# Altium schematic sheet [03] - MCU.SchDoc
size A4
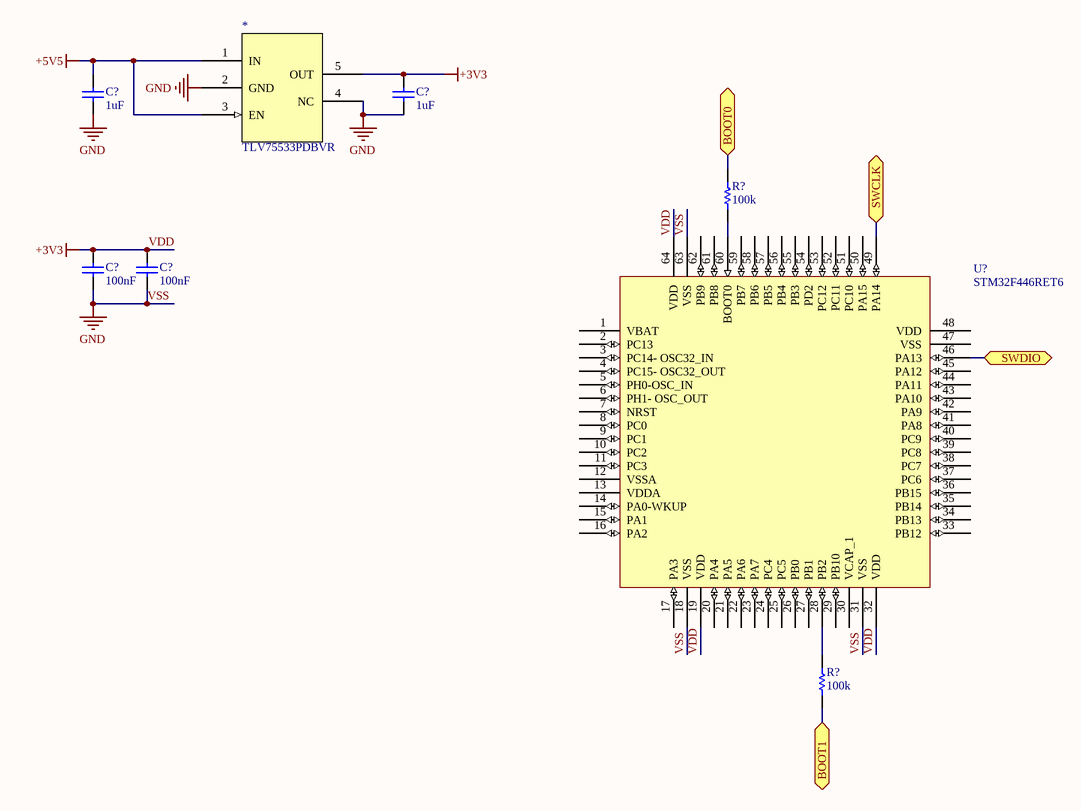
[diagram p0: [03] - MCU.SchDoc]

## Parts
(Parts that share a designator on the sheet are numbered #1, #2 ... from top to bottom, then left to right.)
*  TLV75533PDBVR  [SOT23127P600-8N]
C?#1  1uF
C?#2  1uF
C?#3  100nF
C?#4  100nF
R?#1  100k
R?#2  100k
U?  STM32F446RET6

## Ports
BOOT0, BOOT1, SWCLK, SWDIO

## Nets
+5V5: *.1(IN) *.3(EN) C?#1.2
VDD: *.5(OUT) C?#2.2 C?#3.2 C?#4.2 U?.19(VDD) U?.32(VDD) U?.64(VDD)  [also labelled +3V3]
VSS: *.2(GND) *.4(NC) C?#1.1 C?#2.1 C?#3.1 C?#4.1 U?.18(VSS) U?.31(VSS) U?.63(VSS)  [also labelled GND]
BOOT0: R?#1.2 ; port BOOT0
BOOT1: R?#2.1 ; port BOOT1
SWCLK: U?.49(PA14) ; port SWCLK
SWDIO: U?.46(PA13) ; port SWDIO
NetR?#1_1: R?#1.1 U?.60(BOOT0)
NetR?#2_2: R?#2.2 U?.28(PB2)

Not connected (* = marked no-connect by the designer): U? 1(VBAT) 2(PC13) 3(PC14-_OSC32_IN) 4(PC15-_OSC32_OUT) 5(PH0-OSC_IN) 6(PH1-_OSC_OUT) 7(NRST) 8(PC0) 9(PC1) 10(PC2) 11(PC3) 12(VSSA) 13(VDDA) 14(PA0-WKUP) 15(PA1) 16(PA2) 17(PA3) 20(PA4) 21(PA5) 22(PA6) 23(PA7) 24(PC4) 25(PC5) 26(PB0) 27(PB1) 29(PB10) 30(VCAP_1) 33(PB12) 34(PB13) 35(PB14) 36(PB15) 37(PC6) 38(PC7) 39(PC8) 40(PC9) 41(PA8) 42(PA9) 43(PA10) 44(PA11) 45(PA12) 47(VSS) 48(VDD) 50(PA15) 51(PC10) 52(PC11) 53(PC12) 54(PD2) 55(PB3) 56(PB4) 57(PB5) 58(PB6) 59(PB7) 61(PB8) 62(PB9)

## Library data of the parts
* = TLV75533PDBVR: LDO Voltage Regulators 500-mA, Low IQ, Small Size, Low Dropout Regulator 5-SOT-23 -40 to 125; Manufacturer: Texas Instruments; Input Voltage MAX: 5.5 V; Number of Outputs: 1 Output; Output Current: 500 mA; Output Type: Fixed; Output Voltage: 3.3 V; Quiescent Current: 25 uA; Dropout Voltage - Max: 215 mV; PSRR / Ripple Rejection - Typ: 46 dB; Voltage Regulation Accuracy: 1.5 %; CNHTS: 8542319000; Dropout Voltage: 220 mV; Input Voltage MIN: 1.45 V; Line Regulation: 2 mV; Load Regulation: 0.06 V/A; Polarity: Positive; Product Status: New Product; Supplier 1: Mouser; Manufacturer Part Number: TLV75533PDBVR; RoHS: RoHS Compliant; Category: LDO Voltage Regulators; Stock 1: 52559; Pricing 1: 1=0.541, 10=0.454, 100=0.292, 1000=0.234, 2000=0.212, 3000=0.197, 9000=0.190 (EUR); Operating Temperature Range: - 40 C to + 125 C; Package/Case: SOT-23-5; Packaging: Cut Tape; Product: LDO Voltage Regulators; Series: TLV755P; Type: Low Quiescent Current, Ultra Small; Brand: Texas Instruments; Mounting Style: SMD/SMT; Output Voltage Range: -; HTS Code: 8542390001; Maximum Operating Temperature: + 125 C; Minimum Operating Temperature: - 40 C; Product Type: LDO Voltage Regulators; Standard Pack Qty: 3000; Subcategory: PMIC - Power Management ICs; RoHS - Mouser: Y; Minimum Order Quantity: 1; Reeling: True; Supplier Part Number 1: 595-TLV75533PDBVR
C?#1 C?#2 = GRM32RF51E105ZA01L: Multilayer Ceramic Capacitors MLCC - SMD/SMT 1210 1uF 25volts Y5V +80-20%; Manufacturer: Murata Electronics; Tolerance: - 20 %, + 80 %; Type: Chip Multilayer Ceramic Capacitor for General Purpose; Voltage Rating DC: 25 VDC; Capacitance - nF: 1000 nF; Class: Class 2; CNHTS: 8532241000; TARIC: 8532240000; Product Status: Not Recommended for New Designs; Supplier 1: Mouser; Manufacturer Part Number: GRM32RF51E105ZA01L; RoHS: RoHS Compliant; Category: Multilayer Ceramic Capacitors MLCC - SMD/SMT; Stock 1: 0; Pricing 1: 1=0.358, 10=0.249, 100=0.149, 500=0.113, 1000=0.099 (EUR); Capacitance: 1 uF; Height: 1.8 mm; Length: 3.2 mm; Package/Case: 1210 (3225 metric); Packaging: Cut Tape; Product: General Type MLCCs; Series: GRM; Termination Style: SMD/SMT; Width: 2.5 mm; Brand: Murata Electronics; Case Code - in: 1210; Case Code - mm: 3225; Dielectric: Y5V; HTS Code: 8532240020; Maximum Operating Temperature: + 85 C; Minimum Operating Temperature: - 30 C; Product Type: Ceramic Capacitors; Standard Pack Qty: 1000; Subcategory: Capacitors; Termination: Standard; RoHS - Mouser: Y; Minimum Order Quantity: 1; Reeling: True; ComponentLink1URL: http://www.mouser.com/datasheet/2/281/murata_03052018_GRM_Series_1-1310166.pdf; ComponentLink1Description: http://www.mouser.com/datasheet/2/281/murata_03052018_GRM_Series_1-1310166.pdf; Supplier Part Number 1: 81-GRM32F51E105ZA01L
C?#3 C?#4 = GCJ32DR72E104KXJ1L: Multilayer Ceramic Capacitors MLCC - SMD/SMT 1210 0.1 uF 250volt X7R 10% Soft Term; Manufacturer: Murata Electronics; Capacitance: 0.1 uF; Type: Surface Mount MLCC; Voltage Rating DC: 250 VDC; Capacitance - pF: 100000 pF; Class: Class 2; CNHTS: 8532241000; Qualification: AEC-Q200; TARIC: 8532240000; Supplier 1: Mouser; Manufacturer Part Number: GCJ32DR72E104KXJ1L; RoHS: RoHS Compliant; Category: Multilayer Ceramic Capacitors MLCC - SMD/SMT; Stock 1: 2841; Pricing 1: 1=0.638, 10=0.469, 100=0.321, 250=0.308, 500=0.255, 1000=0.215 (EUR); Height: 1.25 mm; Length: 3.2 mm; Package/Case: 1210 (3224 metric); Packaging: Cut Tape; Product: Automotive MLCCs; Series: GCJ; Termination Style: SMD/SMT; Tolerance: 10 %; Width: 2.5 mm; Brand: Murata Electronics; Capacitance - nF: 100 nF; Case Code - in: 1210; Case Code - mm: 3225; Dielectric: X7R; HTS Code: 8532240020; Maximum Operating Temperature: + 125 C; Minimum Operating Temperature: - 55 C; Product Type: Ceramic Capacitors; Standard Pack Qty: 1000; Subcategory: Capacitors; Termination: Flexible (Soft); RoHS - Mouser: Y; Minimum Order Quantity: 1; Reeling: True; ComponentLink1URL: http://www.mouser.com/datasheet/2/281/c03e-516224.pdf; ComponentLink1Description: http://www.mouser.com/datasheet/2/281/c03e-516224.pdf; Supplier Part Number 1: 81-GCJ32DR72E104KX1L
R?#1 R?#2 = RC1210FR-07100KL: Thick Film Resistors - SMD 100K OHM 1%; Manufacturer: Yageo; Power Rating: 500 mW (1/2 W); Resistance: 100 kOhms; Temperature Coefficient: 100 PPM / C; Voltage Rating: 200 V; CNHTS: 8533211000; MXHTS: 85332101; TARIC: 8533210000; Supplier 1: Mouser; Manufacturer Part Number: RC1210FR-07100KL; RoHS: RoHS Compliant; Category: Thick Film Resistors - SMD; Stock 1: 2923; Pricing 1: 1=0.140, 10=0.082, 100=0.027, 1000=0.018, 5000=0.014, 10000=0.013, 50000=0.012 (EUR); Application: High Reliability; Features: -; Height: 0.55 mm; Length: 3.1 mm; Package/Case: 1210 (3225 metric); Packaging: Cut Tape; Product: Thick Film Resistors SMD; Series: RC; Technology: Thick Film; Termination Style: SMD/SMT; Tolerance: 1 %; Type: General Purpose; Width: 2.6 mm; Brand: Yageo; Mounting Style: PCB Mount; Case Code - in: 1210; Case Code - mm: 3225; HTS Code: 8533210030; Maximum Operating Temperature: + 155 C; Minimum Operating Temperature: - 55 C; Product Type: Thick Film Resistors; Standard Pack Qty: 5000; Subcategory: Resistors; RoHS - Mouser: Y; Minimum Order Quantity: 1; Reeling: True; ComponentLink1URL: http://www.mouser.com/datasheet/2/447/PYu-RC_Group_51_RoHS_L_9-1314892.pdf; ComponentLink1Description: http://www.mouser.com/datasheet/2/447/PYu-RC_Group_51_RoHS_L_9-1314892.pdf; Supplier Part Number 1: 603-RC1210FR-07100KL
U? = STM32F446RET6: ARM Microcontrollers - MCU High-performance foundation line, ARM Cortex-M4 core with DSP and FPU, 512 Kbytes Flash, 180 MHz CPU, ART Accelerator, Dual QSPI; Manufacturer: STMicroelectronics; Data RAM Size: 128 kB; Data RAM Type: SRAM; Interface Type: CAN, HDMI, I2C, I2S, SAI, SDIO, SPI, USART, USB; Number of I/Os: 50 I/O; Program Memory Size: 512 kB; ADC Resolution: 12 bit; Analogue Supply Voltage: 3.3 V; CNHTS: 8542319000; Core: ARM Cortex M4; Data Bus Width: 32 bit; Maximum Clock Frequency: 180 MHz; MXHTS: 85423102; Number of ADC Channels: 16 Channel; Number of Timers/Counters: 14 Timer; Processor Series: STM32; Supply Voltage - Max: 3.6 V; Supply Voltage - Min: 1.7 V; Chcked: 0; Supplier 1: Mouser; Manufacturer Part Number: STM32F446RET6; RoHS: RoHS Compliant; Category: ARM Microcontrollers - MCU; Stock 1: 3733; Pricing 1: 1=7.50, 10=6.79, 25=6.47, 100=5.62, 250=5.36, 500=4.89, 1000=4.26, 2500=4.10 (EUR); Length: 10 mm; Package/Case: LQFP-64; Product: MCU+FPU; Program Memory Type: Flash; Series: STM32F446RE; Brand: STMicroelectronics; Mounting Style: SMD/SMT; DAC Resolution: 12 bit; HTS Code: 8542310001; I/O Voltage: 3.3 V; Maximum Operating Temperature: + 85 C; Minimum Operating Temperature: - 40 C; Operating Supply Voltage: 3.3 V; Standard Pack Qty: 960; TARIC: 8542319000; Tradename: STM32; RoHS - Mouser: Y; Minimum Order Quantity: 1; Reeling: False; ComponentLink1URL: http://www.mouser.com/datasheet/2/389/stm32f446mc-956216.pdf; ComponentLink1Description: http://www.mouser.com/datasheet/2/389/stm32f446mc-956216.pdf; Supplier Part Number 1: 511-STM32F446RET6